# EAGLE design PDB Arduino (EAGLE 9.6.2)
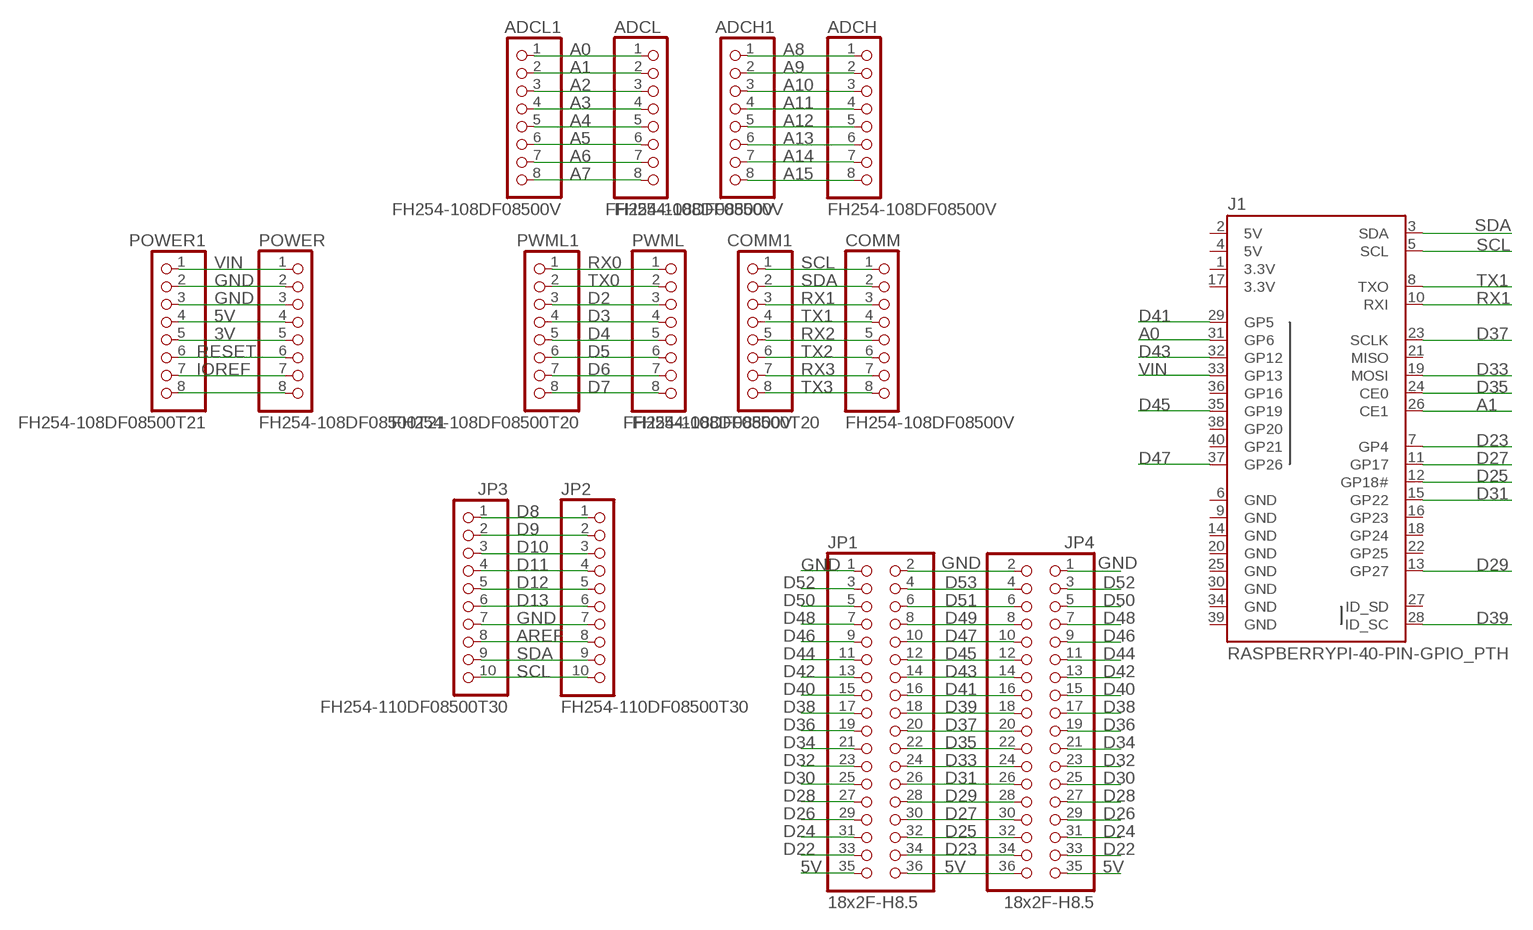
[diagram p0: schematic, sheet 1]

## Parts
ADCH  FH254-108DF08500V  CONNETTORI_0058_FH254-108DF08500V  [CONNETTORI_1X08]
ADCH1  FH254-108DF08500V  CONNETTORI_0058_FH254-108DF08500V  [CONNETTORI_1X08]
ADCL  FH254-108DF08500V  CONNETTORI_0058_FH254-108DF08500V  [CONNETTORI_1X08]
ADCL1  FH254-108DF08500V  CONNETTORI_0058_FH254-108DF08500V  [CONNETTORI_1X08]
COMM  FH254-108DF08500V  CONNETTORI_0058_FH254-108DF08500V  [CONNETTORI_1X08]
COMM1  FH254-108DF08500V  CONNETTORI_0058_FH254-108DF08500V  [CONNETTORI_1X08]
J1  RASPBERRYPI-40-PIN-GPIO_PTH  [2X20_SHROUDED]
JP1  18x2F-H8.5  CONNETTORI_0060_FH254-218DF08500V  [CONNETTORI_2X18]
JP2  FH254-110DF08500T30  CONNETTORI_1216_FH254-110DF08500T30  [CONNETTORI_1X10]
JP3  FH254-110DF08500T30  CONNETTORI_1216_FH254-110DF08500T30  [CONNETTORI_1X10]
JP4  18x2F-H8.5  CONNETTORI_0060_FH254-218DF08500V  [CONNETTORI_2X18]
POWER  FH254-108DF08500T21  CONNETTORI_1217_FH254-108DF08500T21  [CONNETTORI_1X08]
POWER1  FH254-108DF08500T21  CONNETTORI_1217_FH254-108DF08500T21  [CONNETTORI_1X08]
PWML  FH254-108DF08500T20  CONNETTORI_1218_FH254-108DF08500T20  [CONNETTORI_1X08]
PWML1  FH254-108DF08500T20  CONNETTORI_1218_FH254-108DF08500T20  [CONNETTORI_1X08]

## Nets
3V: POWER1.5 POWER.5
5V: JP1.35 JP1.36 JP4.35 JP4.36 POWER1.4 POWER.4
A0: ADCL1.1 ADCL.1 J1.31(GP6)
A1: ADCL1.2 ADCL.2 J1.26(CE1)
A2: ADCL1.3 ADCL.3
A3: ADCL1.4 ADCL.4
A4: ADCL1.5 ADCL.5
A5: ADCL1.6 ADCL.6
A6: ADCL1.7 ADCL.7
A7: ADCL1.8 ADCL.8
A8: ADCH1.1 ADCH.1
A9: ADCH1.2 ADCH.2
A10: ADCH1.3 ADCH.3
A11: ADCH1.4 ADCH.4
A12: ADCH1.5 ADCH.5
A13: ADCH1.6 ADCH.6
A14: ADCH1.7 ADCH.7
A15: ADCH1.8 ADCH.8
AREF: JP2.8 JP3.8
D2: PWML1.3 PWML.3
D3: PWML1.4 PWML.4
D4: PWML1.5 PWML.5
D5: PWML1.6 PWML.6
D6: PWML1.7 PWML.7
D7: PWML1.8 PWML.8
D8: JP2.1 JP3.1
D9: JP2.2 JP3.2
D10: JP2.3 JP3.3
D11: JP2.4 JP3.4
D12: JP2.5 JP3.5
D13: JP2.6 JP3.6
D22: JP1.33 JP4.33
D23: J1.7(GP4) JP1.34 JP4.34
D24: JP1.31 JP4.31
D25: J1.12(GP18#) JP1.32 JP4.32
D26: JP1.29 JP4.29
D27: J1.11(GP17) JP1.30 JP4.30
D28: JP1.27 JP4.27
D29: J1.13(GP27) JP1.28 JP4.28
D30: JP1.25 JP4.25
D31: J1.15(GP22) JP1.26 JP4.26
D32: JP1.23 JP4.23
D33: J1.19(MOSI) JP1.24 JP4.24
D34: JP1.21 JP4.21
D35: J1.24(CE0) JP1.22 JP4.22
D36: JP1.19 JP4.19
D37: J1.23(SCLK) JP1.20 JP4.20
D38: JP1.17 JP4.17
D39: J1.28(ID_SC) JP1.18 JP4.18
D40: JP1.15 JP4.15
D41: J1.29(GP5) JP1.16 JP4.16
D42: JP1.13 JP4.13
D43: J1.32(GP12) JP1.14 JP4.14
D44: JP1.11 JP4.11
D45: J1.35(GP19) JP1.12 JP4.12
D46: JP1.9 JP4.9
D47: J1.37(GP26) JP1.10 JP4.10
D48: JP1.7 JP4.7
D49: JP1.8 JP4.8
D50: JP1.5 JP4.5
D51: JP1.6 JP4.6
D52: JP1.3 JP4.3
D53: JP1.4 JP4.4
GND: JP1.1 JP1.2 JP2.7 JP3.7 JP4.1 JP4.2 POWER1.2 POWER1.3 POWER.2 POWER.3
IOREF: POWER1.7 POWER.7
N$8: POWER1.8 POWER.8
RESET: POWER1.6 POWER.6
RX0: PWML1.1 PWML.1
RX1: COMM1.3 COMM.3 J1.10(RXI)
RX2: COMM1.5 COMM.5
RX3: COMM1.7 COMM.7
SCL: COMM1.1 COMM.1 J1.5(SCL) JP2.10 JP3.10
SDA: COMM1.2 COMM.2 J1.3(SDA) JP2.9 JP3.9
TX0: PWML1.2 PWML.2
TX1: COMM1.4 COMM.4 J1.8(TXO)
TX2: COMM1.6 COMM.6
TX3: COMM1.8 COMM.8
VIN: J1.33(GP13) POWER1.1 POWER.1
Unconnected: J1.16(GP23) J1.18(GP24) J1.21(MISO) J1.22(GP25) J1.27(ID_SD) J1.36(GP16) J1.38(GP20) J1.40(GP21)

## Power pins joined to a net without a drawn wire
3.3V: J1.1(3.3V) J1.17(3.3V)
5V: J1.2(5V) J1.4(5V)
GND: J1.6(GND) J1.9(GND) J1.14(GND) J1.20(GND) J1.25(GND) J1.30(GND) J1.34(GND) J1.39(GND)

## Library data of the parts
ADCH ADCH1 ADCL ADCL1 COMM COMM1 = MEGA2560_Rev3e:CONNETTORI_0058_FH254-108DF08500V: Female Connector strip for Arduino bases - 8x1 F V h 8,5 p2,54mm; MONTHLY_USAGE: _____; PART_NUMBER: FH254-108DF08500V; PRICE: _____; SUPPLIER: _____; TYPE: Connettori
J1 = SparkFun-Connectors:RASPBERRYPI-40-PIN-GPIO: Raspberry Pi GPIO Header 2x20 pin connector, as found on B, B+, A+ models. Both shrouded PTH and SMT versions available. SparkFun Products: GPIO Shrouded Header <https://www.sparkfun.com/products/13054>- PTH SparkFun Pi Wedge (Preassembled) <https://www.sparkfun.com/products/13717>; PROD_ID: CONN-12263; SF_ID: PRT-13054
JP1 JP4 = MEGA2560_Rev3e:CONNETTORI_0060_FH254-218DF08500V: 18x2 F V h 8,5 p2,54; MONTHLY_USAGE: _____; PART_NUMBER: FH254-218DF08500V; PRICE: _____; SUPPLIER: _____; TYPE: Connettori
JP2 JP3 = MEGA2560_Rev3e:CONNETTORI_1216_FH254-110DF08500T30: Female Connector strip for Arduino bases - 10x1 F V h 8,5 p2,54 serigrafato STRISCIA VUOTA; MONTHLY_USAGE: _____; PART_NUMBER: FH254-110DF08500T30; PRICE: _____; SUPPLIER: _____; TYPE: Connettori
POWER POWER1 = MEGA2560_Rev3e:CONNETTORI_1217_FH254-108DF08500T21: Female Connector strip for Arduino bases - 8x1 F V h 8,5 p2,54 serigrafato POWER; MONTHLY_USAGE: _____; PART_NUMBER: FH254-108DF08500T21; PRICE: _____; SUPPLIER: _____; TYPE: Connettori
PWML PWML1 = MEGA2560_Rev3e:CONNETTORI_1218_FH254-108DF08500T20: Female Connector strip for Arduino bases - 8x1 F V h 8,5 p2,54 serigrafato DIGITAL; MONTHLY_USAGE: _____; PART_NUMBER: FH254-108DF08500T20; PRICE: _____; SUPPLIER: _____; TYPE: Connettori

## Board
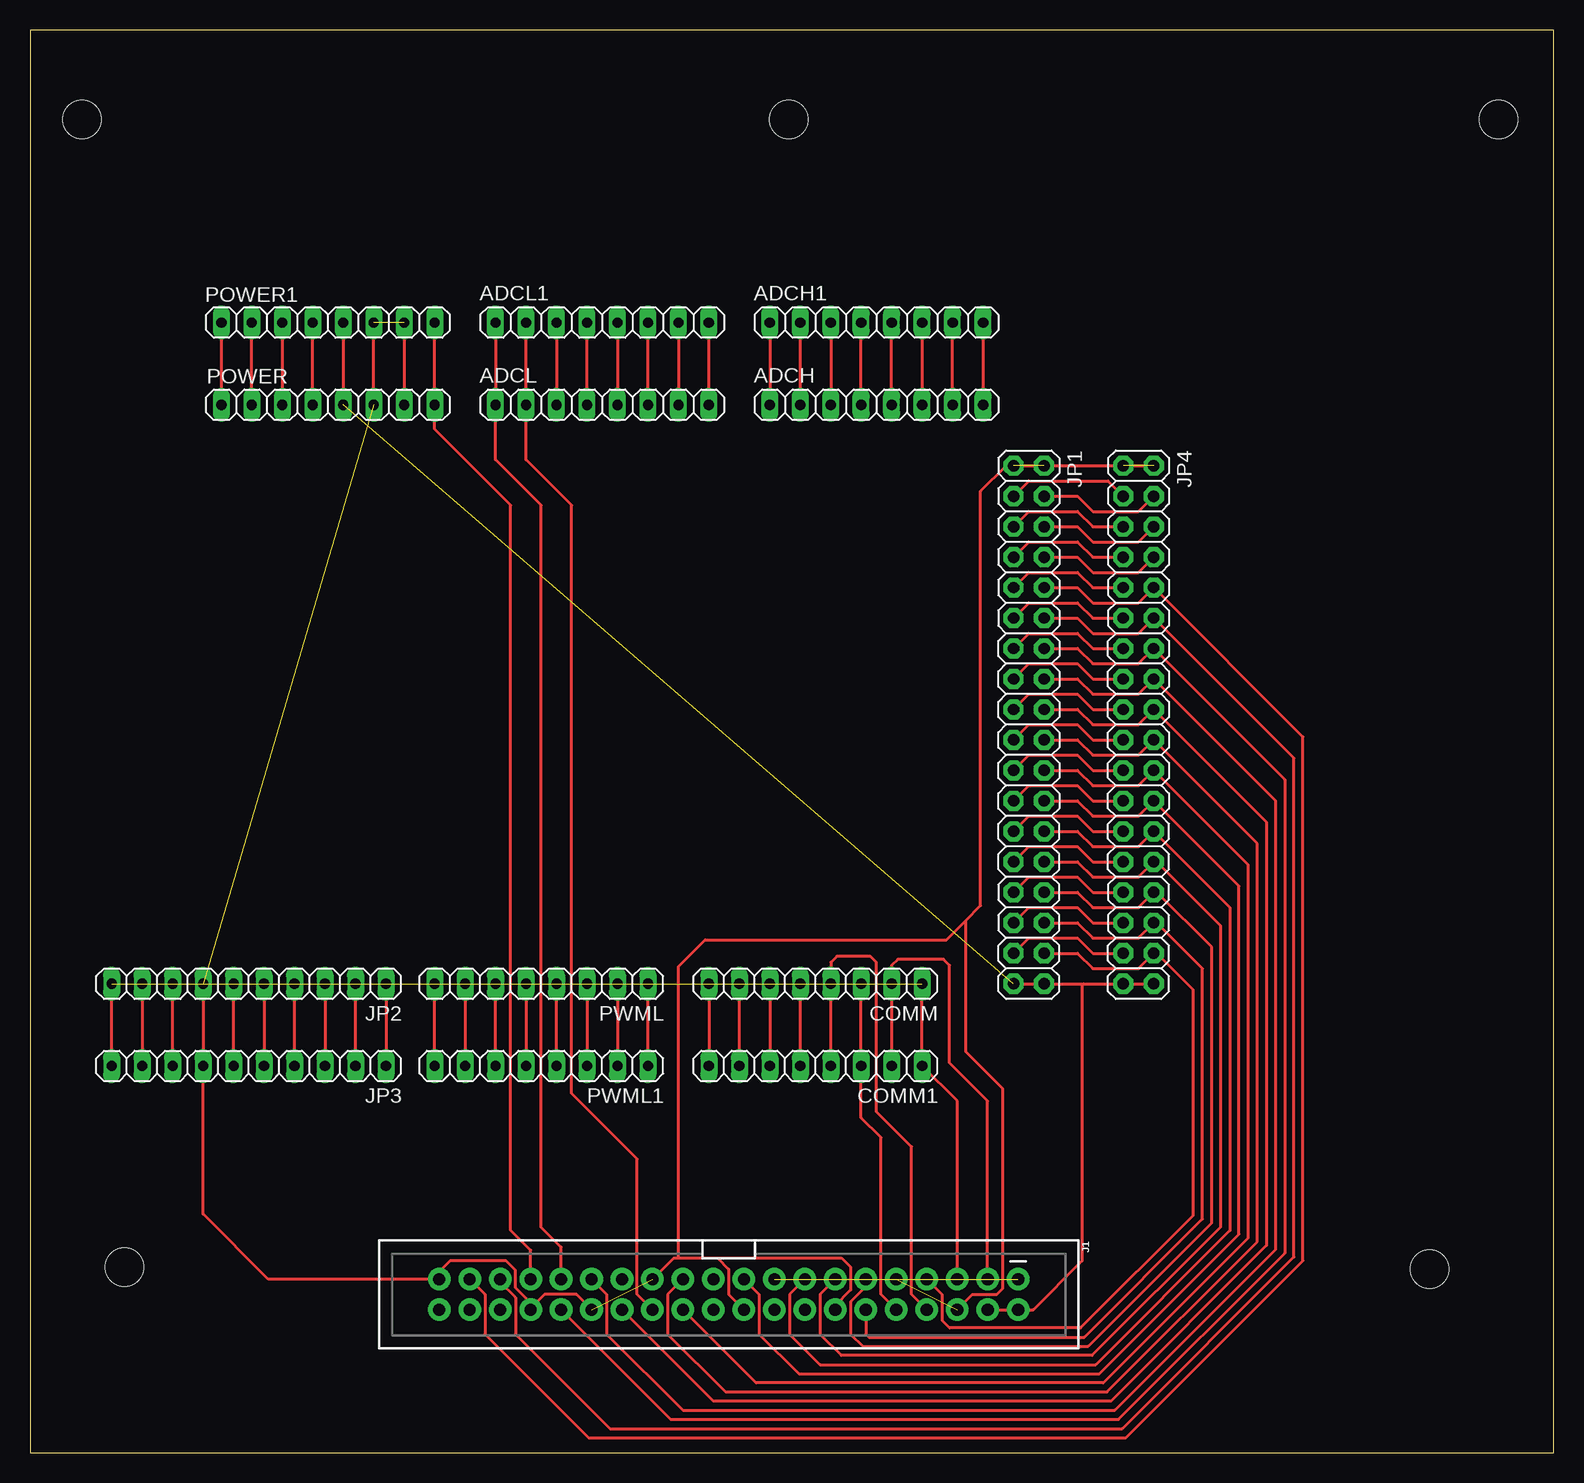
[diagram p1: board, top side]
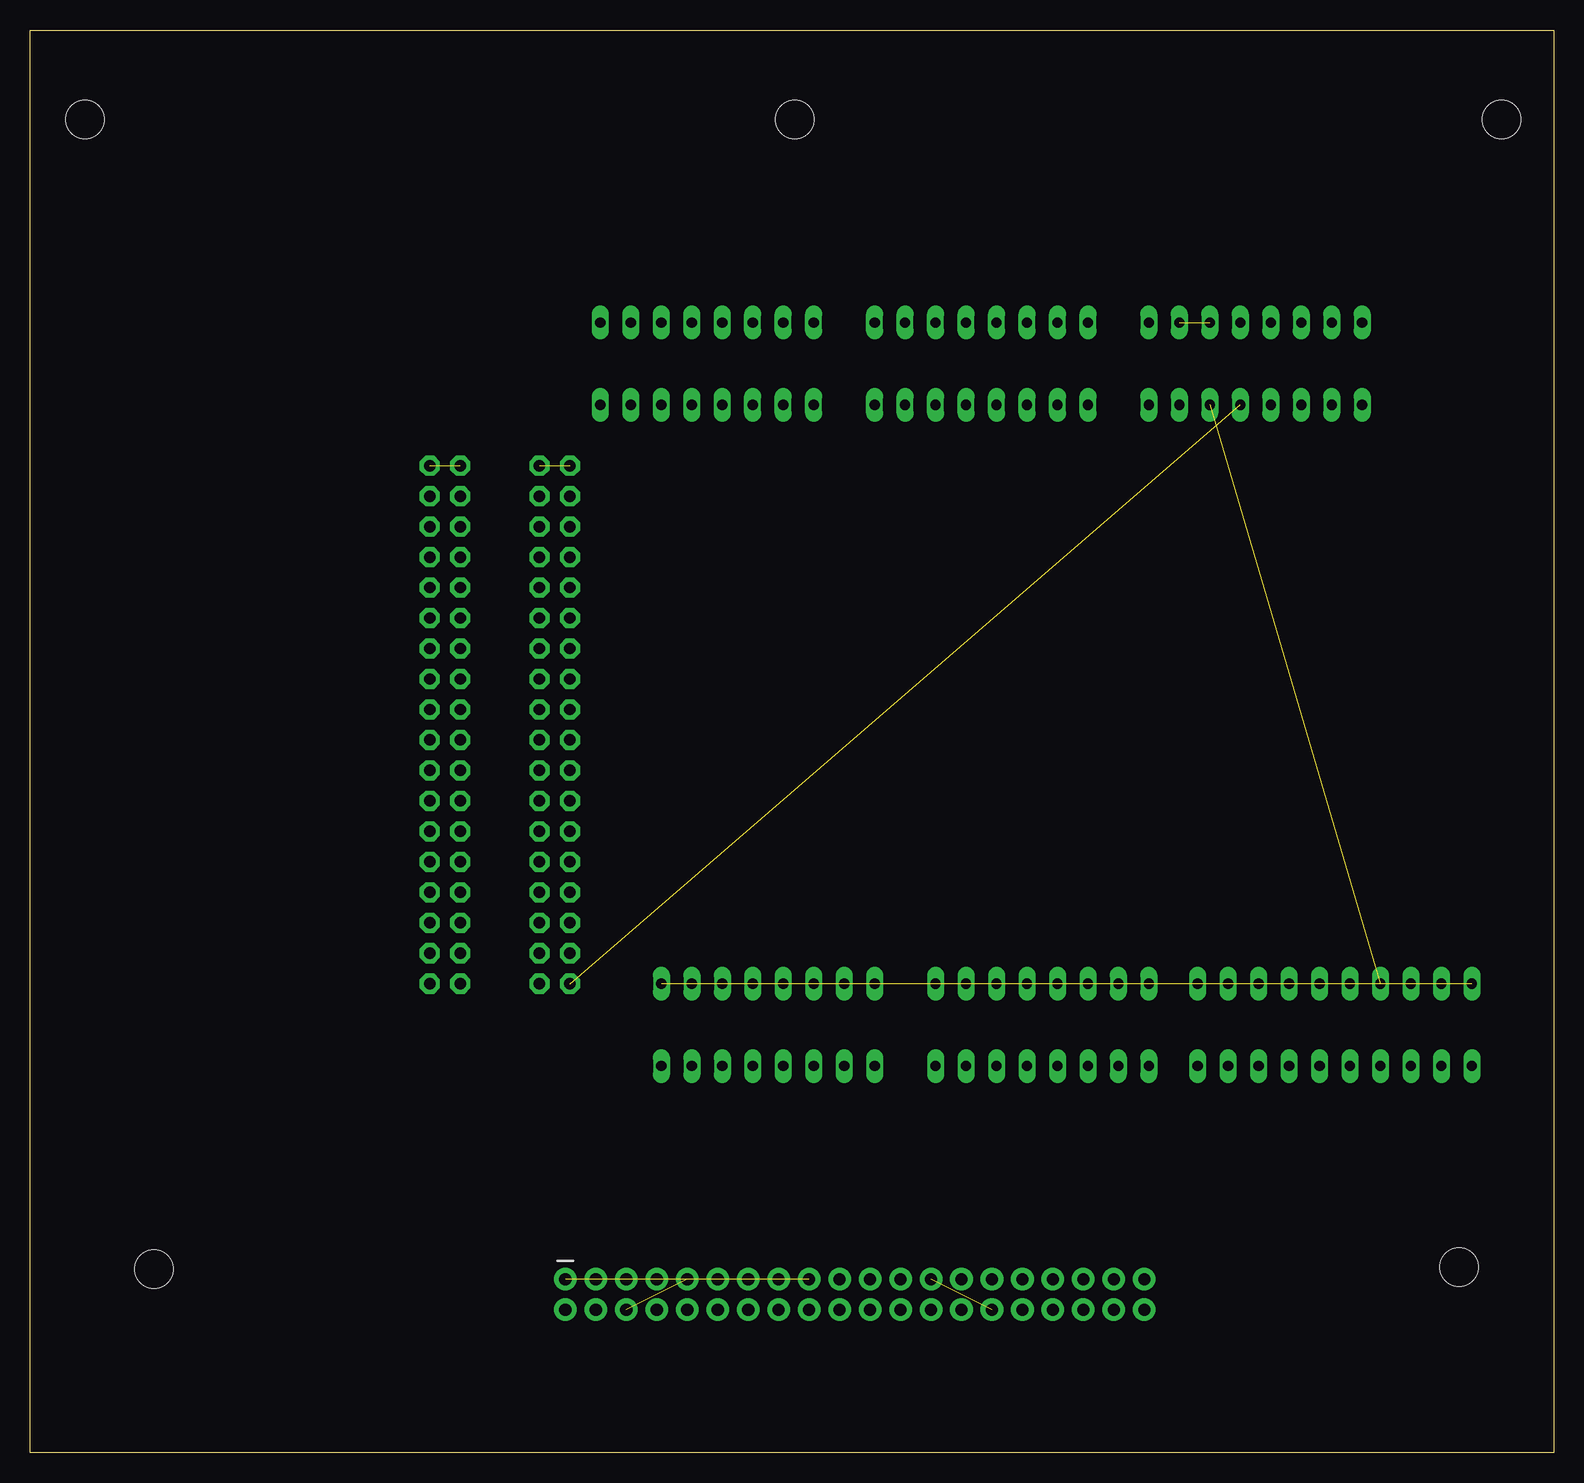
[diagram p2: board, bottom side, seen from below]

Size 127 x 118.62 mm. Coordinates in mm from the lower left corner, seen from the top.
Outline: 0,0 127,0 127,118.62 0,118.62 0,0
Copper layers (1*16): Top 0.035mm / dielectric 1.5mm / Bottom 0.035mm
Design rules "default": minimum track width 6mil, minimum drill 0.35mm, track to track 6mil, track to pad 6mil, pad to pad 6mil, via to via 6mil, smd to smd 6mil, copper to edge 40mil, drill to drill 6mil, minimum pad ring 10mil, minimum via ring 8mil, stop-mask expansion 4mil, vias tented up to drill 0mil, thermal gap 10mil
Holes 3.2 mm at 63.25,111.18 116.66,15.34 7.87,15.49 4.32,111.18 122.43,111.18

### Footprints (pad centres in the part's own frame; a part is rotated, then mirrored left to right if it is on the bottom)
CONNETTORI_1X08 = drill 0.85 pad 1.422 long: 1 -8.89,0; 2 -6.35,0; 3 -3.81,0; 4 -1.27,0; 5 1.27,0; 6 3.81,0; 7 6.35,0; 8 8.89,0
2X20_SHROUDED = drill 1.016 pad 1.88: 1 -1.27,24.13; 2 1.27,24.13; 3 -1.27,21.59; 4 1.27,21.59; 5 -1.27,19.05; 6 1.27,19.05; 7 -1.27,16.51; 8 1.27,16.51; 9 -1.27,13.97; 10 1.27,13.97; 11 -1.27,11.43; 12 1.27,11.43; 13 -1.27,8.89; 14 1.27,8.89; 15 -1.27,6.35; 16 1.27,6.35; 17 -1.27,3.81; 18 1.27,3.81; 19 -1.27,1.27; 20 1.27,1.27; 21 -1.27,-1.27; 22 1.27,-1.27; 23 -1.27,-3.81; 24 1.27,-3.81; 25 -1.27,-6.35; 26 1.27,-6.35; 27 -1.27,-8.89; 28 1.27,-8.89; 29 -1.27,-11.43; 30 1.27,-11.43; 31 -1.27,-13.97; 32 1.27,-13.97; 33 -1.27,-16.51; 34 1.27,-16.51; 35 -1.27,-19.05; 36 1.27,-19.05; 37 -1.27,-21.59; 38 1.27,-21.59; 39 -1.27,-24.13; 40 1.27,-24.13
CONNETTORI_2X18 = drill 0.95 pad 1.676 octagon: 1 -21.59,-1.27; 2 -21.59,1.27; 3 -19.05,-1.27; 4 -19.05,1.27; 5 -16.51,-1.27; 6 -16.51,1.27; 7 -13.97,-1.27; 8 -13.97,1.27; 9 -11.43,-1.27; 10 -11.43,1.27; 11 -8.89,-1.27; 12 -8.89,1.27; 13 -6.35,-1.27; 14 -6.35,1.27; 15 -3.81,-1.27; 16 -3.81,1.27; 17 -1.27,-1.27; 18 -1.27,1.27; 19 1.27,-1.27; 20 1.27,1.27; 21 3.81,-1.27; 22 3.81,1.27; 23 6.35,-1.27; 24 6.35,1.27; 25 8.89,-1.27; 26 8.89,1.27; 27 11.43,-1.27; 28 11.43,1.27; 29 13.97,-1.27; 30 13.97,1.27; 31 16.51,-1.27; 32 16.51,1.27; 33 19.05,-1.27; 34 19.05,1.27; 35 21.59,-1.27; 36 21.59,1.27
CONNETTORI_1X10 = drill 0.85 pad 1.422 long: 1 -11.43,0; 2 -8.89,0; 3 -6.35,0; 4 -3.81,0; 5 -1.27,0; 6 1.27,0; 7 3.81,0; 8 6.35,0; 9 8.89,0; 10 11.43,0

### Placement (x,y rotation side)
ADCH  70.56,87.38 0 top
ADCH1  70.56,94.23 0 top
ADCL  47.7,87.38 0 top
ADCL1  47.7,94.23 0 top
COMM  65.48,39.12 180 top
COMM1  65.48,32.26 180 top
J1  58.24,13.21 270 top
JP1  83.26,60.71 270 top
JP2  18.24,39.12 180 top
JP3  18.24,32.26 180 top
JP4  92.41,60.71 270 top
POWER  24.84,87.38 180 top
POWER1  24.84,94.23 180 top
PWML  42.62,39.12 180 top
PWML1  42.62,32.26 180 top

### Tracks (layer width: path | path; a pad name or v marks a point on that pad's centre or on a via)
3.3V  (1 unrouted)
3V
  Top 0.254: POWER.5 POWER1.5
5V  (1 unrouted)
  Top 0.254: 87.83,39.12 JP1.36 JP1.35 81.99,38.86 | 87.83,39.12 JP4.35 JP4.36 | J1.4 J1.2 83.64,11.94 87.71,16 87.71,38.99 87.83,39.12 | POWER1.4 POWER.4
A0
  Top 0.254: ADCL1.1 ADCL.1 38.81,82.8 42.62,78.99 42.62,18.8 44.27,17.14 J1.31
A1
  Top 0.254: ADCL1.2 ADCL.2 41.35,82.8 45.16,78.99 45.16,29.97 50.62,24.51 50.62,13.21 J1.26
A2
  Top 0.254: ADCL1.3 ADCL.3
A3
  Top 0.254: ADCL.4 ADCL1.4
A4
  Top 0.254: ADCL1.5 ADCL.5
A5
  Top 0.254: ADCL.6 ADCL1.6
A6
  Top 0.254: ADCL1.7 ADCL.7
A7
  Top 0.254: ADCL.8 ADCL1.8
A8
  Top 0.254: ADCH1.1 ADCH.1
A9
  Top 0.254: ADCH.2 ADCH1.2
A10
  Top 0.254: ADCH1.3 ADCH.3
A11
  Top 0.254: ADCH.4 ADCH1.4
A12
  Top 0.254: ADCH.5 ADCH1.5
A13
  Top 0.254: ADCH1.6 ADCH.6
A14
  Top 0.254: ADCH.7 ADCH1.7
A15
  Top 0.254: ADCH1.8 ADCH.8
AREF
  Top 0.254: JP3.8 JP2.8
D2
  Top 0.254: PWML.3 PWML1.3
D3
  Top 0.254: PWML1.4 PWML.4
D4
  Top 0.254: PWML.5 PWML1.5
D5
  Top 0.254: PWML1.6 PWML.6
D6
  Top 0.254: PWML.7 PWML1.7
D7
  Top 0.254: PWML1.8 PWML.8
D8
  Top 0.254: JP2.1 JP3.1
D9
  Top 0.254: JP3.2 JP2.2
D10
  Top 0.254: JP2.3 JP3.3
D11
  Top 0.254: JP3.4 JP2.4
D12
  Top 0.254: JP2.5 JP3.5
D13
  Top 0.254: JP3.6 JP2.6
D22
  Top 0.254: JP1.33 83.26,42.93 87.33,42.93 88.59,41.66 JP4.33
D23
  Top 0.254: JP1.34 87.33,41.66 88.59,40.39 92.41,40.39 JP4.34 93.93,41.66 96.98,38.61 96.98,19.81 87.58,10.41 76.66,10.41 76.02,11.05 76.02,13.21 J1.7
D24
  Top 0.254: JP1.31 83.26,45.47 87.33,45.47 88.59,44.2 JP4.31
D25
  Top 0.254: JP1.32 87.33,44.2 88.59,42.93 92.41,42.93 JP4.32 93.93,44.2 97.74,40.39 97.74,19.5 87.89,9.65 69.93,9.65 69.67,9.91 J1.12
D26
  Top 0.254: JP1.29 83.26,48.01 87.33,48.01 88.59,46.74 JP4.29
D27
  Top 0.254: JP1.30 87.33,46.74 88.59,45.47 92.41,45.47 JP4.30 93.93,46.74 98.5,42.16 98.5,19.18 88.21,8.89 69.42,8.89 68.4,9.91 68.4,12.6 69.67,13.87 J1.11
D28
  Top 0.254: JP1.27 83.26,50.55 87.33,50.55 88.59,49.28 JP4.27
D29
  Top 0.254: JP1.28 87.33,49.28 88.59,48.01 92.41,48.01 JP4.28 93.93,49.28 99.26,43.94 99.26,18.86 88.53,8.13 67.64,8.13 65.86,9.91 65.86,13.21 J1.13
D30
  Top 0.254: JP1.25 83.26,53.09 87.33,53.09 88.59,51.82 JP4.25
D31
  Top 0.254: JP1.26 87.33,51.82 88.59,50.55 92.41,50.55 JP4.26 100.03,45.47 100.03,18.55 88.84,7.37 65.86,7.37 63.32,9.91 63.32,13.21 J1.15
D32
  Top 0.254: JP1.23 83.26,55.63 87.33,55.63 88.59,54.36 JP4.23
D33
  Top 0.254: JP1.24 87.33,54.36 88.59,53.09 92.41,53.09 JP4.24 100.79,47.24 100.79,18.23 89.16,6.6 64.08,6.6 60.78,9.91 60.78,13.21 J1.19
D34
  Top 0.254: JP1.21 83.26,58.17 87.33,58.17 88.59,56.9 JP4.21
D35
  Top 0.254: JP1.22 87.33,56.9 88.59,55.63 92.41,55.63 JP4.22 101.55,49.02 101.55,17.92 89.47,5.84 60.53,5.84 J1.24
D36
  Top 0.254: JP1.19 83.26,60.71 87.33,60.71 88.59,59.44 JP4.19
D37
  Top 0.254: JP1.20 87.33,59.44 88.59,58.17 92.41,58.17 JP4.20 102.31,50.8 102.31,17.6 89.79,5.08 57.99,5.08 53.16,9.91 53.16,13.21 J1.23
D38
  Top 0.254: JP1.17 83.26,63.25 87.33,63.25 88.59,61.98 JP4.17
D39
  Top 0.254: JP1.18 87.33,61.98 88.59,60.71 92.41,60.71 JP4.18 103.07,52.58 103.07,17.29 90.1,4.32 56.97,4.32 J1.28
D40
  Top 0.254: JP1.15 83.26,65.79 87.33,65.79 88.59,64.52 JP4.15
D41
  Top 0.254: JP1.16 87.33,64.52 88.59,63.25 92.41,63.25 JP4.16 103.83,54.36 103.83,16.97 90.42,3.56 54.43,3.56 48.08,9.91 48.08,13.21 J1.29
D42
  Top 0.254: JP1.13 83.26,68.33 87.33,68.33 88.59,67.06 JP4.13
D43
  Top 0.254: JP1.14 87.33,67.06 88.59,65.79 92.41,65.79 JP4.14 104.6,56.13 104.6,16.66 90.74,2.79 53.42,2.79 J1.32
D44
  Top 0.254: JP1.11 83.26,70.87 87.33,70.87 88.59,69.6 JP4.11
D45
  Top 0.254: JP1.12 87.33,69.6 88.59,68.33 92.41,68.33 JP4.12 105.36,57.91 105.36,16.34 91.05,2.03 48.34,2.03 40.46,9.91 40.46,12.95 39.19,14.22 J1.35
D46
  Top 0.254: JP1.9 83.26,73.41 87.33,73.41 88.59,72.14 JP4.9
D47
  Top 0.254: JP1.10 87.33,72.14 88.59,70.87 92.41,70.87 JP4.10 106.12,59.69 106.12,16.02 91.37,1.27 46.56,1.27 37.92,9.91 37.92,13.21 J1.37
D48
  Top 0.254: JP1.7 83.26,75.95 87.33,75.95 88.59,74.68 JP4.7
D49
  Top 0.254: JP1.8 87.33,74.68 88.59,73.41 92.41,73.41 JP4.8
D50
  Top 0.254: JP1.5 83.26,78.49 87.33,78.49 88.59,77.22 JP4.5
D51
  Top 0.254: JP1.6 87.33,77.22 88.59,75.95 92.41,75.95 JP4.6
D52
  Top 0.254: JP1.3 83.26,81.03 89.86,81.03 JP4.3
D53
  Top 0.254: JP1.4 87.33,79.76 88.59,78.49 92.41,78.49 JP4.4
GND  (6 unrouted)
  Top 0.254: JP1.2 87.33,82.3 | JP4.2 JP1.1 81.38,82.3 79.25,80.16 79.25,45.62 78.03,44.4 | JP2.7 JP3.7 14.43,19.91 19.86,14.48 J1.39 34.11,15.11 35,16 39.7,16 40.46,15.24 40.46,13.77 41.73,12.5 J1.34 41.73,12.06 42.88,13.21 45.54,13.21 J1.30 | POWER.3 POWER1.3 | POWER1.2 POWER.2 | J1.14 67.13,12.32 68.4,13.59 68.4,15.49 67.64,16.26 57.3,16.26 | J1.25 53.67,16.26 54.05,16.26 | 54.05,16.26 57.3,16.26 | 57.3,16.26 58.24,15.32 58.24,13.21 J1.20 | 54.05,16.26 54.05,40.54 56.29,42.77 76.4,42.77 78.03,44.4 | J1.6 78.56,13.21 80.59,13.21 81.1,13.72 81.1,30.35 78.03,33.43 78.03,44.4
IOREF
  Top 0.254: POWER.7 POWER1.7
N$8
  Top 0.254: POWER1.8 POWER.8
RESET
  Top 0.254: POWER1.6 POWER.6
RX0
  Top 0.254: PWML1.1 PWML.1
RX1
  Top 0.254: COMM.3 COMM1.3 69.29,27.94 70.94,26.29 70.94,13.21 J1.10
RX2
  Top 0.254: COMM1.5 COMM.5
RX3
  Top 0.254: COMM1.7 COMM.7
SCL  (1 unrouted)
  Top 0.254: JP3.10 JP2.10 | COMM.1 COMM1.1 77.29,29.34 J1.5
SDA  (1 unrouted)
  Top 0.254: JP2.9 JP3.9 | COMM1.2 COMM.2 71.83,40.64 72.34,41.15 76.15,41.15 76.66,40.64 76.66,32.51 79.83,29.34 J1.3
TX0
  Top 0.254: PWML.2 PWML1.2
TX1
  Top 0.254: COMM1.4 COMM.4 66.75,40.89 67.26,41.4 70.05,41.4 70.56,40.89 70.56,28.45 73.48,25.53 73.48,13.21 J1.8
TX2
  Top 0.254: COMM.6 COMM1.6
TX3
  Top 0.254: COMM.8 COMM1.8
VIN
  Top 0.254: 41.73,14.73 J1.33 41.73,16.89 40.08,18.54 40.08,78.99 33.73,85.34 POWER.1 POWER1.1